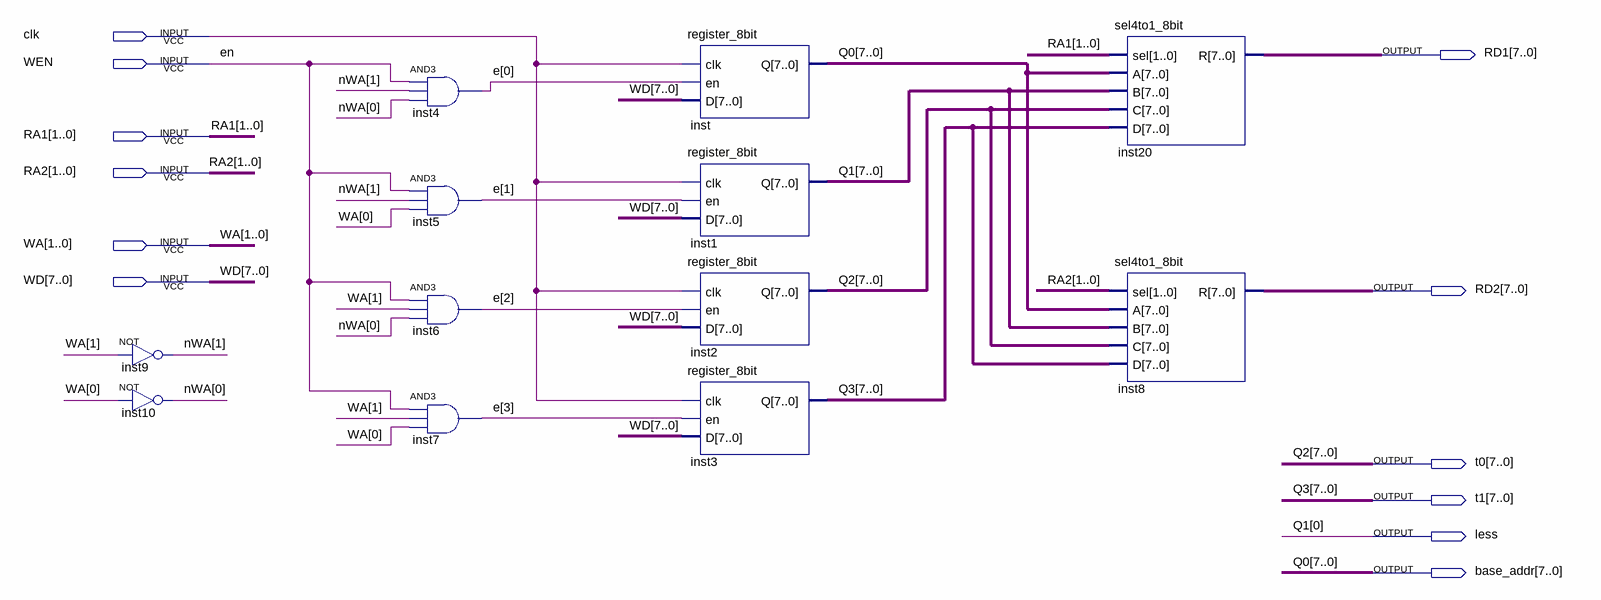
[diagram p0: schematic sheet]
// Quartus schematic RegisterFile.bdf as structural Verilog: 12 symbols, 12 pins
module RegisterFile (
  input  clk,
  input  WEN,
  input  [1:0] RA1,
  input  [1:0] RA2,
  input  [1:0] WA,
  input  [7:0] WD,
  output [7:0] RD1,
  output [7:0] RD2,
  output [7:0] t0,
  output [7:0] t1,
  output less,
  output [7:0] base_addr
);

  wire [1:0] nWA;
  wire [3:0] e;
  wire [7:1] Q1;

  not inst9 (nWA[1], WA[1]);
  not inst10 (nWA[0], WA[0]);
  and inst4 (e[0], WEN, nWA[1], nWA[0]);
  and inst5 (e[1], WEN, nWA[1], WA[0]);
  and inst6 (e[2], WEN, WA[1], nWA[0]);
  and inst7 (e[3], WEN, WA[1], WA[0]);
  register_8bit inst (.clk(clk), .en(e[0]), .D(WD), .Q(base_addr));
  register_8bit inst1 (.clk(clk), .en(e[1]), .D(WD), .Q({Q1, less}));
  register_8bit inst2 (.clk(clk), .en(e[2]), .D(WD), .Q(t0));
  register_8bit inst3 (.clk(clk), .en(e[3]), .D(WD), .Q(t1));
  sel4to1_8bit inst20 (.sel(RA1), .A(base_addr), .B({Q1, less}), .C(t0), .D(t1), .R(RD1));
  sel4to1_8bit inst8 (.sel(RA2), .A(base_addr), .B({Q1, less}), .C(t0), .D(t1), .R(RD2));

  // Other names for the same wires on the sheet: en = WEN; Q0[7:0] = base_addr; Q1[0] = less; Q2[7:0] = t0;
  //   Q3[7:0] = t1
endmodule
